# EAGLE design CPU68K8 (EAGLE 7.7.0)
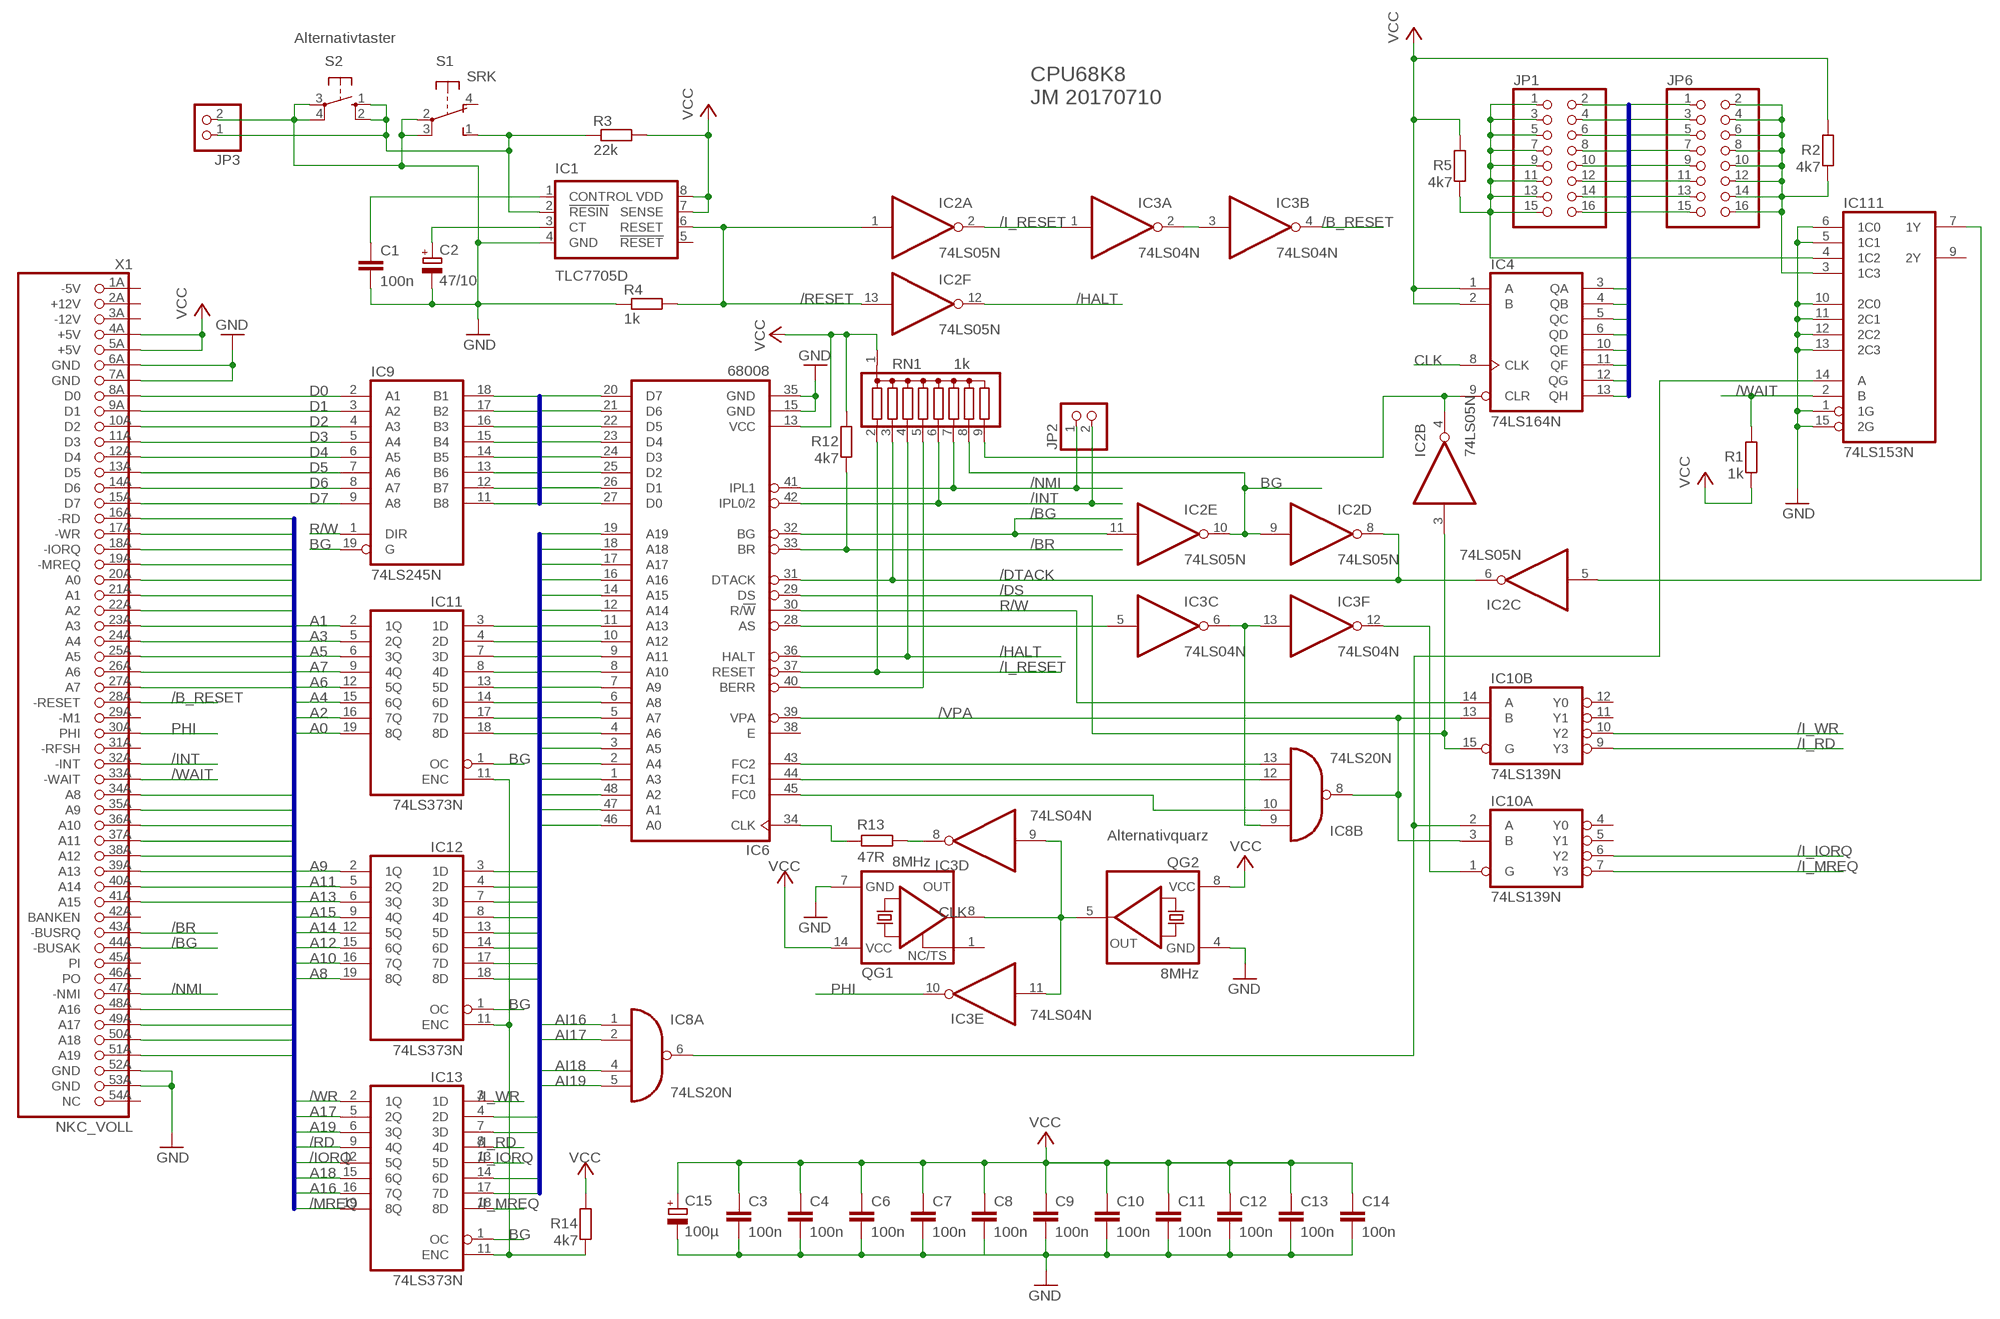
[diagram p0: schematic, sheet 1]

## Parts
C1  100n  C-EU025-025X050  [C025-025X050]
C2  47/10  CPOL-EUE2.5-6  [E2,5-6]
C3  100n  C-EU025-025X050  [C025-025X050]
C4  100n  C-EU025-025X050  [C025-025X050]
C6  100n  C-EU025-025X050  [C025-025X050]
C7  100n  C-EU025-025X050  [C025-025X050]
C8  100n  C-EU025-025X050  [C025-025X050]
C9  100n  C-EU025-025X050  [C025-025X050]
C10  100n  C-EU025-025X050  [C025-025X050]
C11  100n  C-EU025-025X050  [C025-025X050]
C12  100n  C-EU025-025X050  [C025-025X050]
C13  100n  C-EU025-025X050  [C025-025X050]
C14  100n  C-EU025-025X050  [C025-025X050]
C15  100µ  CPOL-EUE2.5-6  [E2,5-6]
IC1  TLC7705D  [DIL08]
IC2  74LS05N  [DIL14]
IC3  74LS04N  [DIL14]
IC4  74LS164N  [DIL14]
IC6  68008  MC68008P  [DIL48]
IC8  74LS20N  [DIL14]
IC9  74LS245N  [DIL20]
IC10  74LS139N  [DIL16]
IC11  74LS373N  [DIL20]
IC12  74LS373N  [DIL20]
IC13  74LS373N  [DIL20]
IC111  74LS153N  [DIL16]
JP1  PINHD-2X8  [2X08]
JP2  PINHD-1X2  [1X02]
JP3  PINHD-1X2/90  [1X02/90]
JP6  PINHD-2X8  [2X08]
QG1  8MHz  XO-14  [DIL14S]
QG2  8MHz  QG5460  [DIL08S]
R1  1k  R-EU_0207/10  [0207/10]
R2  4k7  R-EU_0207/10  [0207/10]
R3  22k  R-EU_0207/10  [0207/10]
R4  1k  R-EU_0207/10  [0207/10]
R5  4k7  R-EU_0207/10  [0207/10]
R12  4k7  R-EU_0207/10  [0207/10]
R13  47R  R-EU_0207/10  [0207/10]
R14  4k7  R-EU_0207/10  [0207/10]
RN1  1k  G08R  [SIL9]
S1  SRK  [SRK]
S2  10-XX  [B3F-10XX]
X1  NKC_VOLL  [1X54/90_PCB]

## Nets
/B_RESET: IC3.4(B:O) X1.28A(-RESET)
/BG: IC2.11(E:I) IC6.32(BG) X1.44A(-BUSAK)
/BR: IC6.33(BR) R12.1 X1.43A(-BUSRQ)
/DS: IC2.3(B:I) IC6.29(DS) IC10.15(B:G)
/DTACK: IC2.6(C:O) IC2.8(D:O) IC6.31(DTACK) RN1.3
/HALT: IC2.12(F:O) IC6.36(HALT) RN1.4
/I_IORQ: IC10.6(A:Y2) IC13.13(5D)
/I_MREQ: IC10.7(A:Y3) IC13.18(8D)
/I_RD: IC10.9(B:Y3) IC13.8(4D)
/I_RESET: IC2.2(A:O) IC3.1(A:I) IC6.37(RESET) RN1.2
/I_WR: IC10.10(B:Y2) IC13.3(1D)
/INT: IC6.42(IPL0/2) JP2.2 RN1.6 X1.32A(-INT)
/IORQ: IC13.12(5Q) X1.18A(-IORQ)
/MREQ: IC13.19(8Q) X1.19A(-MREQ)
/NMI: IC6.41(IPL1) JP2.1 RN1.7 X1.47A(-NMI)
/RD: IC13.9(4Q) X1.16A(-RD)
/RESET: IC1.6(RESET) IC2.1(A:I) IC2.13(F:I) R4.2
/VPA: IC6.39(VPA) IC8.8(B:O) IC10.3(A:B) IC10.13(B:B)
/WAIT: IC111.2(B) R1.2 X1.33A(-WAIT)
/WR: IC13.2(1Q) X1.17A(-WR)
A0: IC11.19(8Q) X1.20A(A0)
A1: IC11.2(1Q) X1.21A(A1)
A2: IC11.16(7Q) X1.22A(A2)
A3: IC11.5(2Q) X1.23A(A3)
A4: IC11.15(6Q) X1.24A(A4)
A5: IC11.6(3Q) X1.25A(A5)
A6: IC11.12(5Q) X1.26A(A6)
A7: IC11.9(4Q) X1.27A(A7)
A8: IC12.19(8Q) X1.34A(A8)
A9: IC12.2(1Q) X1.35A(A9)
A10: IC12.16(7Q) X1.36A(A10)
A11: IC12.5(2Q) X1.37A(A11)
A12: IC12.15(6Q) X1.38A(A12)
A13: IC12.6(3Q) X1.39A(A13)
A14: IC12.12(5Q) X1.40A(A14)
A15: IC12.9(4Q) X1.41A(A15)
A16: IC13.16(7Q) X1.48A(A16)
A17: IC13.5(2Q) X1.49A(A17)
A18: IC13.15(6Q) X1.50A(A18)
A19: IC13.6(3Q) X1.51A(A19)
AI0: IC6.46(A0) IC11.18(8D)
AI1: IC6.47(A1) IC11.3(1D)
AI2: IC6.48(A2) IC11.17(7D)
AI3: IC6.1(A3) IC11.4(2D)
AI4: IC6.2(A4) IC11.14(6D)
AI5: IC6.3(A5) IC11.7(3D)
AI6: IC6.4(A6) IC11.13(5D)
AI7: IC6.5(A7) IC11.8(4D)
AI8: IC6.6(A8) IC12.18(8D)
AI9: IC6.7(A9) IC12.3(1D)
AI10: IC6.8(A10) IC12.17(7D)
AI11: IC6.9(A11) IC12.4(2D)
AI12: IC6.10(A12) IC12.14(6D)
AI13: IC6.11(A13) IC12.7(3D)
AI14: IC6.12(A14) IC12.13(5D)
AI15: IC6.14(A15) IC12.8(4D)
AI16: IC6.16(A16) IC8.1(A:I0) IC13.17(7D)
AI17: IC6.17(A17) IC8.2(A:I1) IC13.4(2D)
AI18: IC6.18(A18) IC8.4(A:I2) IC13.14(6D)
AI19: IC6.19(A19) IC8.5(A:I3) IC13.7(3D)
BG: IC2.9(D:I) IC2.10(E:O) IC9.19(G) IC11.1(OC) IC12.1(OC) IC13.1(OC) RN1.8
CLK: IC3.9(D:I) IC3.11(E:I) IC4.8(CLK) QG1.8(OUT) QG2.5(OUT)
D0: IC9.2(A1) X1.8A(D0)
D1: IC9.3(A2) X1.9A(D1)
D2: IC9.4(A3) X1.10A(D2)
D3: IC9.5(A4) X1.11A(D3)
D4: IC9.6(A5) X1.12A(D4)
D5: IC9.7(A6) X1.13A(D5)
D6: IC9.8(A7) X1.14A(D6)
D7: IC9.9(A8) X1.15A(D7)
DI0: IC6.27(D0) IC9.18(B1)
DI1: IC6.26(D1) IC9.17(B2)
DI2: IC6.25(D2) IC9.16(B3)
DI3: IC6.24(D3) IC9.15(B4)
DI4: IC6.23(D4) IC9.14(B5)
DI5: IC6.22(D5) IC9.13(B6)
DI6: IC6.21(D6) IC9.12(B7)
DI7: IC6.20(D7) IC9.11(B8)
GND [supp]: C1.2 C2.- C3.2 C4.2 C6.2 C7.2 C8.2 C9.2 C10.2 C11.2 C12.2 C13.2 C14.2 C15.- IC1.4(GND) IC6.15(GND) IC6.35(GND) IC111.1(1G) IC111.5(1C1) IC111.6(1C0) IC111.10(2C0) IC111.11(2C1) IC111.12(2C2) IC111.13(2C3) IC111.15(2G) JP3.2 QG1.7(GND) QG2.4(GND) R4.1 S1.2(P) S1.3(P) S2.3(P) S2.4(P1) X1.6A(GND) X1.7A(GND) X1.52A(GND) X1.53A(GND)
N$9: IC6.43(FC2) IC8.13(B:I3)
N$10: IC6.44(FC1) IC8.12(B:I2)
N$11: IC6.45(FC0) IC8.10(B:I1)
N$12: IC3.5(C:I) IC6.28(AS)
N$13: IC3.6(C:O) IC3.13(F:I) IC8.9(B:I0)
N$14: IC6.34(CLK) R13.2
N$15: IC3.8(D:O) R13.1
N$16: IC2.4(B:O) IC4.9(CLR) RN1.9
N$17: IC3.12(F:O) IC10.1(A:G)
N$18: IC3.2(A:O) IC3.3(B:I)
N$19: IC6.40(BERR) RN1.5
N$20: IC8.6(A:O) IC10.2(A:A) IC111.14(A)
N$23: IC2.5(C:I) IC111.7(1Y)
N$24: IC11.11(ENC) IC12.11(ENC) IC13.11(ENC) R14.1
N$25: C1.1 IC1.1(CONTROL)
N$26: C2.+ IC1.3(CT)
N$27: IC111.4(1C2) JP1.1 JP1.3 JP1.5 JP1.7 JP1.9 JP1.11 JP1.13 JP1.15 R5.1
N$28: IC1.2(!RESIN) JP3.1 R3.1 S1.1(S) S2.1(S) S2.2(S1)
N$29: IC111.3(1C3) JP6.2 JP6.4 JP6.6 JP6.8 JP6.10 JP6.12 JP6.14 JP6.16 R2.1
PHI: IC3.10(E:O) X1.30A(PHI)
R/W: IC6.30(R/!W) IC9.1(DIR) IC10.14(B:A)
VCC [supp]: C3.1 C4.1 C6.1 C7.1 C8.1 C9.1 C10.1 C11.1 C12.1 C13.1 C14.1 C15.+ IC1.7(SENSE) IC1.8(VDD) IC4.1(A) IC4.2(B) IC6.13(VCC) QG1.14(VCC) QG2.8(VCC) R1.1 R2.2 R3.2 R5.2 R12.2 R14.2 RN1.1 X1.4A(+5V) X1.5A(+5V)
WAIT1: IC4.3(QA) JP1.2 JP6.1
WAIT2: IC4.4(QB) JP1.4 JP6.3
WAIT3: IC4.5(QC) JP1.6 JP6.5
WAIT4: IC4.6(QD) JP1.8 JP6.7
WAIT5: IC4.10(QE) JP1.10 JP6.9
WAIT6: IC4.11(QF) JP1.12 JP6.11
WAIT7: IC4.12(QG) JP1.14 JP6.13
WAIT8: IC4.13(QH) JP1.16 JP6.15
Unconnected: IC1.5(!RESET) IC6.38(E) IC10.4(A:Y0) IC10.5(A:Y1) IC10.11(B:Y1) IC10.12(B:Y0) IC111.9(2Y) QG1.1(TS) S1.4(O) X1.29A(-M1) X1.31A(-RFSH) X1.42A(BANKEN) X1.45A(PI) X1.46A(PO) X1.54A(NC)

## Buses
A[0..19],/RD,/WR,/IORQ,/MREQ
DI[0..7]
AI[0..19]
WAIT[1..8]

## Notes on the sheet
- Alternativtaster
- CPU68K8
  JM 20170710
- Alternativquarz

## Power pins joined to a net without a drawn wire
+12V: X1.2A(+12V)
-5V: X1.1A(-5V)
-12V: X1.3A(-12V)
GND: IC2.7(P:GND) IC3.7(P:GND) IC4.7(GND) IC8.7(P:GND) IC9.10(GND) IC10.8(P:GND) IC11.10(GND) IC12.10(GND) IC13.10(GND) IC111.8(GND)
VCC: IC2.14(P:VCC) IC3.14(P:VCC) IC4.14(VCC) IC8.14(P:VCC) IC9.20(VCC) IC10.16(P:VCC) IC11.20(VCC) IC12.20(VCC) IC13.20(VCC) IC111.16(VCC)

## Library data of the parts
C1 C3 C4 C6-C14 = rcl:C-EU: CAPACITOR, European symbol
C2 C15 = rcl:CPOL-EU: POLARIZED CAPACITOR, European symbol
IC1 = texas:TLC77*: MICROPOWER SUPPLY VOLTAGE SUPERVISORS Source: www.ti.com/.. slvs087l.pdf; MF: TEXAS INSTRUMENT CONNECTORS; MPN: TLC7705QP; OC_FARNELL: 8454671; OC_NEWARK: 76C7537
IC2 = 74xx-eu:74*05: Hex INVERTER, open collector
IC3 = 74xx-eu:74*04: Hex INVERTER
IC4 = 74xx-eu:74*164: 8-bit parallel out SHIFT REGISTER
IC6 = micro-mc68000:MC68008P: 68xxx PROCESSOR; OC_FARNELL: unknown; OC_NEWARK: unknown
IC8 = 74xx-eu:74*20: Dual 4-input NAND gate
IC9 = 74xx-eu:74*245: Octal BUS TRANSCEIVER, 3-state
IC10 = 74xx-eu:74*139: Dual 2-line to 4-line DECODER/DEMULTIPLEXER
IC11-IC13 = 74xx-eu:74*373: Octal D type transparent LATCH, edge triggered
IC111 = 74xx-eu:74*153: Dual 4-line to 1-line data SELECTOR/MULTIPLEXER
JP1 JP6 = pinhead:PINHD-2X8: PIN HEADER
JP2 JP3 = pinhead:PINHD-1X2: PIN HEADER
QG1 = crystal:XO-: CRYSTAL; OC_FARNELL: unknown; OC_NEWARK: unknown
QG2 = crystal:QG5460: CRYSTAL RESONATOR; OC_FARNELL: unknown; OC_NEWARK: unknown
R1-R5 R12-R14 = resistor:R-EU_: RESISTOR, European symbol
RN1 = resistor-sil:G08R: SIL RESISTOR; OC_FARNELL: unknown; OC_NEWARK: unknown
S1 = switch-misc:SRK: SWITCH
S2 = switch-omron:10-XX: OMRON SWITCH; MPN: B3F-1000; OC_FARNELL: 176432; OC_NEWARK: 36M3542
X1 = $eigene:NKC_VOLL

## Board
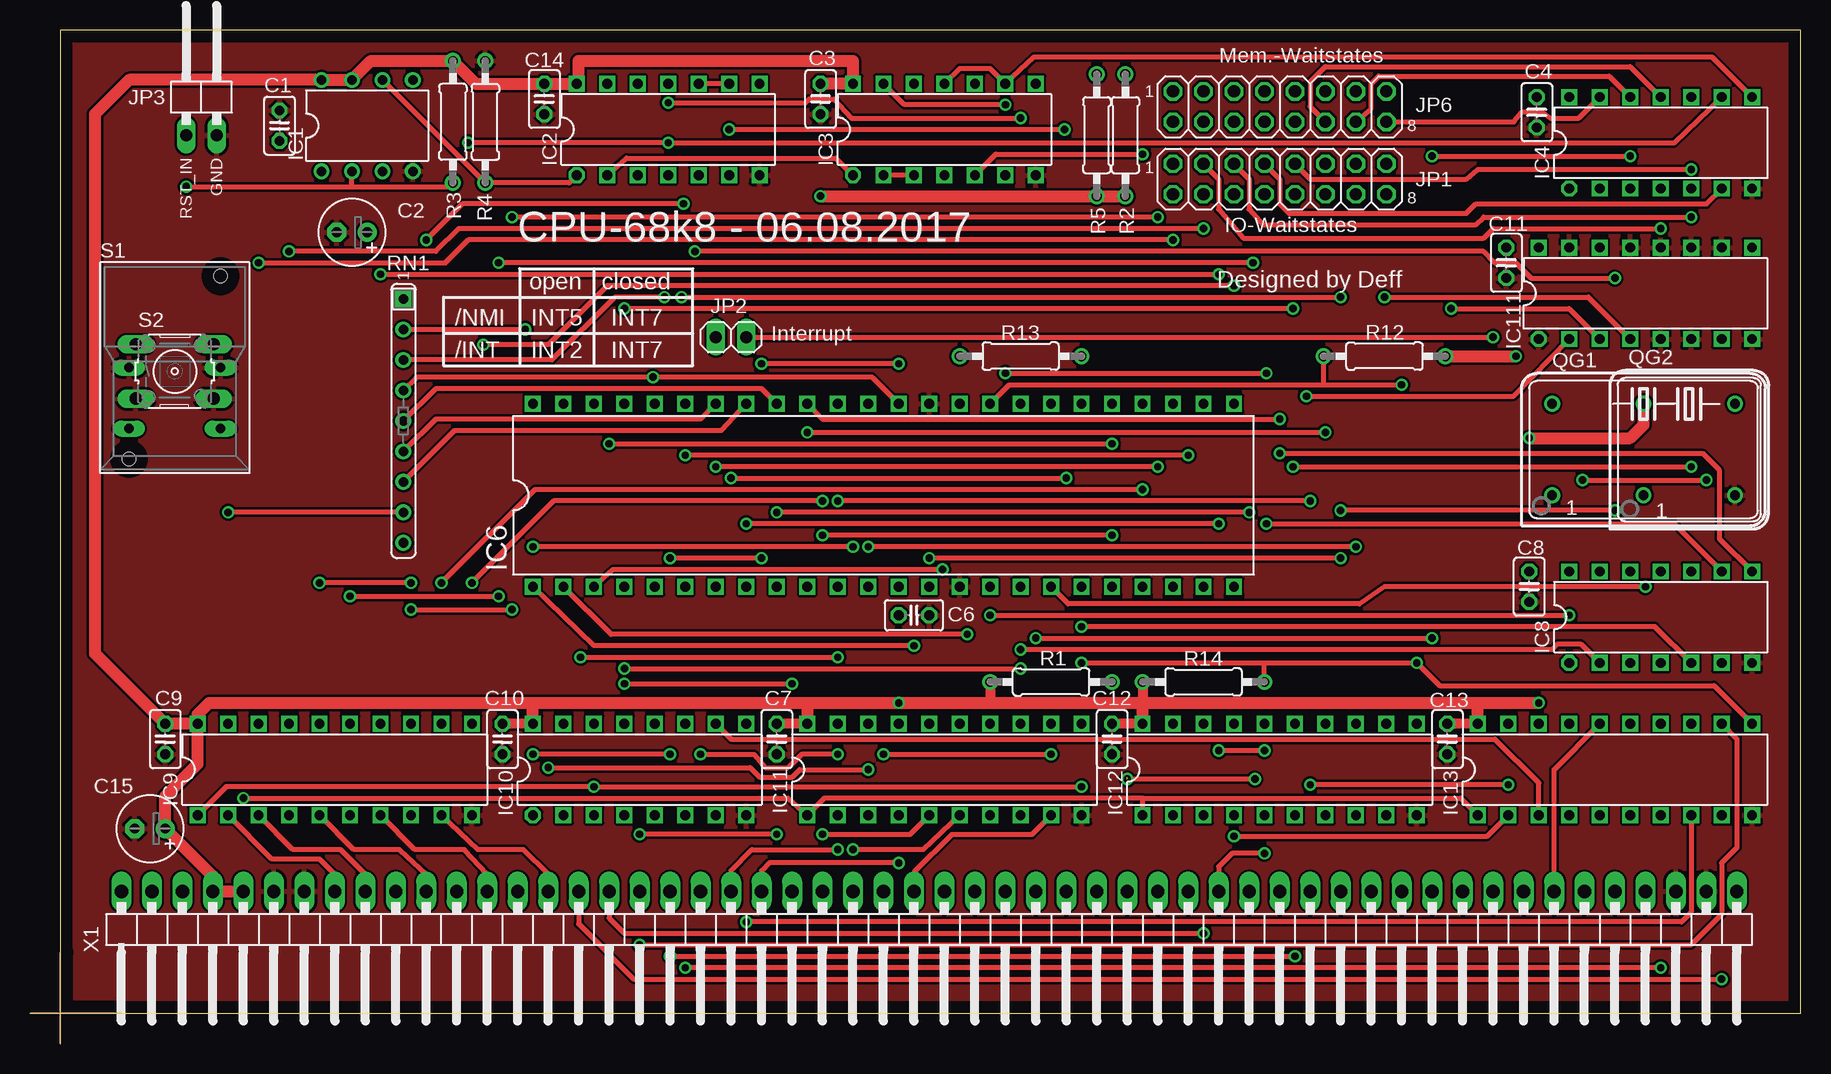
[diagram p1: board, top side]
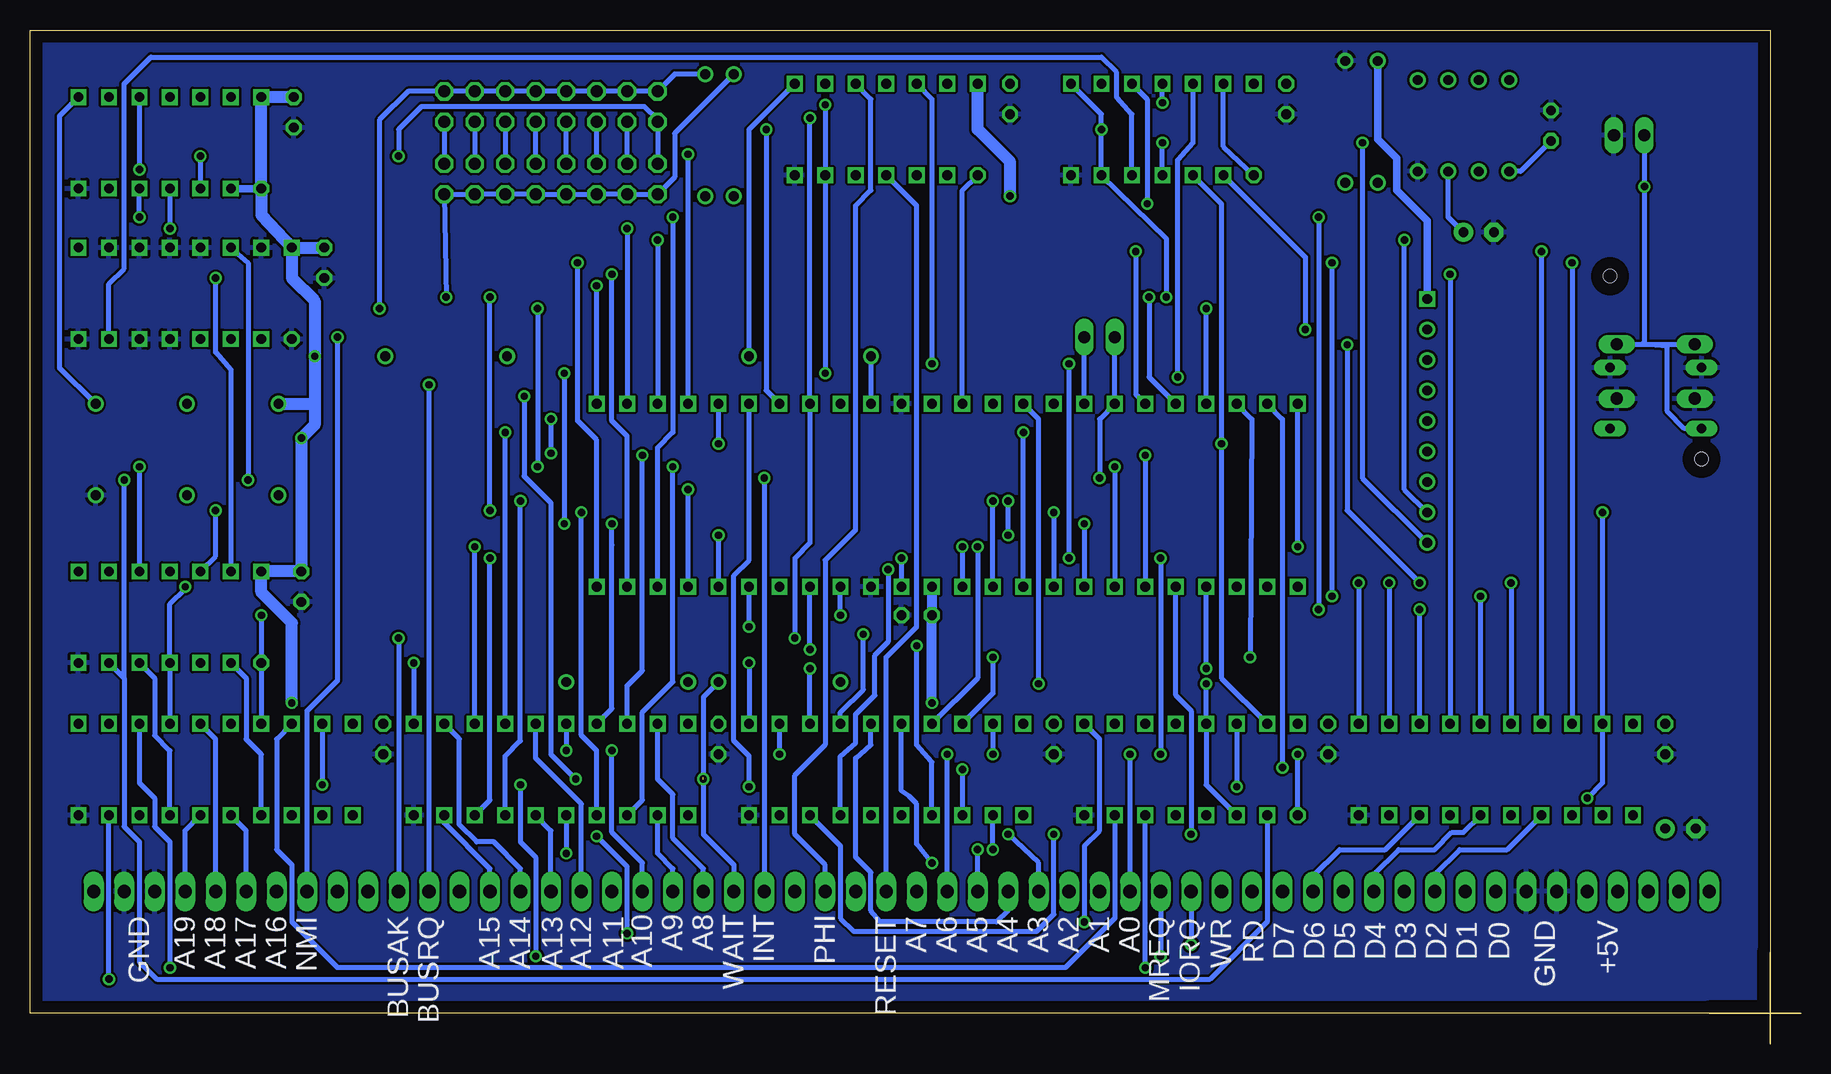
[diagram p2: board, bottom side, seen from below]

Size 145.01 x 81.95 mm. Coordinates in mm from the lower left corner, seen from the top.
Outline: 0,0 145.01,0 145.01,81.95 0,81.95 0,0
Copper layers (1*16): Top 0.035mm / dielectric 1.5mm / Bottom 0.035mm
Design rules "default": minimum track width 10mil, minimum drill 24mil, track to track 8mil, track to pad 8mil, pad to pad 8mil, via to via 8mil, smd to smd 8mil, copper to edge 40mil, drill to drill 8mil, minimum pad ring 10mil, minimum via ring 8mil, stop-mask expansion 4mil, vias tented up to drill 0mil, thermal gap 10mil

### Footprints (pad centres in the part's own frame; a part is rotated, then mirrored left to right if it is on the bottom)
C025-025X050 = drill 0.813 octagon: 1 -1.27,0; 2 1.27,0
E2,5-6 = drill 0.813 pad 1.6: + -1.27,0 | drill 0.813 pad 1.6 octagon: - 1.27,0
DIL08 = drill 0.813 pad 1.27: 1 -3.81,-3.81; 2 -1.27,-3.81; 3 1.27,-3.81; 4 3.81,-3.81; 5 3.81,3.81; 6 1.27,3.81; 7 -1.27,3.81; 8 -3.81,3.81
DIL14 = drill 0.813 octagon: 1 -7.62,-3.81 | drill 0.813 square: 2 -5.08,-3.81; 3 -2.54,-3.81; 4 0,-3.81; 5 2.54,-3.81; 6 5.08,-3.81; 7 7.62,-3.81; 8 7.62,3.81; 9 5.08,3.81; 10 2.54,3.81; 11 0,3.81; 12 -2.54,3.81; 13 -5.08,3.81; 14 -7.62,3.81
DIL48 = drill 0.813 square: 1 -29.21,-7.62; 2 -26.67,-7.62; 3 -24.13,-7.62; 4 -21.59,-7.62; 5 -19.05,-7.62; 6 -16.51,-7.62; 7 -13.97,-7.62; 8 -11.43,-7.62; 9 -8.89,-7.62; 10 -6.35,-7.62; 11 -3.81,-7.62; 12 -1.27,-7.62; 13 1.27,-7.62; 14 3.81,-7.62; 15 6.35,-7.62; 16 8.89,-7.62; 17 11.43,-7.62; 18 13.97,-7.62; 19 16.51,-7.62; 20 19.05,-7.62; 21 21.59,-7.62; 22 24.13,-7.62; 23 26.67,-7.62; 24 29.21,-7.62; 25 29.21,7.62; 26 26.67,7.62; 27 24.13,7.62; 28 21.59,7.62; 29 19.05,7.62; 30 16.51,7.62; 31 13.97,7.62; 32 11.43,7.62; 33 8.89,7.62; 34 6.35,7.62; 35 3.81,7.62; 36 1.27,7.62; 37 -1.27,7.62; 38 -3.81,7.62; 39 -6.35,7.62; 40 -8.89,7.62; 41 -11.43,7.62; 42 -13.97,7.62; 43 -16.51,7.62; 44 -19.05,7.62; 45 -21.59,7.62; 46 -24.13,7.62; 47 -26.67,7.62; 48 -29.21,7.62
DIL20 = drill 0.813 square: 1 -11.43,-3.81; 2 -8.89,-3.81; 3 -6.35,-3.81; 4 -3.81,-3.81; 5 -1.27,-3.81; 6 1.27,-3.81; 7 3.81,-3.81; 8 6.35,-3.81; 9 8.89,-3.81; 10 11.43,-3.81; 11 11.43,3.81; 12 8.89,3.81; 13 6.35,3.81; 14 3.81,3.81; 15 1.27,3.81; 16 -1.27,3.81; 17 -3.81,3.81; 18 -6.35,3.81; 19 -8.89,3.81; 20 -11.43,3.81
DIL16 = drill 0.813 octagon: 1 -8.89,-3.81 | drill 0.813 square: 2 -6.35,-3.81; 3 -3.81,-3.81; 4 -1.27,-3.81; 5 1.27,-3.81; 6 3.81,-3.81; 7 6.35,-3.81; 8 8.89,-3.81; 9 8.89,3.81; 10 6.35,3.81; 11 3.81,3.81; 12 1.27,3.81; 13 -1.27,3.81; 14 -3.81,3.81; 15 -6.35,3.81; 16 -8.89,3.81
2X08 = drill 1.016 octagon: 1 -8.89,-1.27; 2 -8.89,1.27; 3 -6.35,-1.27; 4 -6.35,1.27; 5 -3.81,-1.27; 6 -3.81,1.27; 7 -1.27,-1.27; 8 -1.27,1.27; 9 1.27,-1.27; 10 1.27,1.27; 11 3.81,-1.27; 12 3.81,1.27; 13 6.35,-1.27; 14 6.35,1.27; 15 8.89,-1.27; 16 8.89,1.27
1X02 = drill 1.016 long: 1 -1.27,0; 2 1.27,0
1X02/90 = drill 1.016 long: 1 -1.27,-3.81; 2 1.27,-3.81
DIL14S = drill 0.813: 1 -7.62,-3.81; 7 7.62,-3.81; 8 7.62,3.81; 14 -7.62,3.81
DIL08S = drill 0.813: 1 -3.81,-3.81; 4 3.81,-3.81; 5 3.81,3.81; 8 -3.81,3.81
0207/10 = drill 0.813: 1 -5.08,0; 2 5.08,0
SIL9 = drill 0.813 square: 1 -10.16,0 | drill 0.813: 2 -7.62,0; 3 -5.08,0; 4 -2.54,0; 5 0,0; 6 2.54,0; 7 5.08,0; 8 7.62,0; 9 10.16,0
SRK = drill 0.813 long: 1 -3.81,-5.08; 2 -3.81,0; 3 3.81,0; 4 3.81,-5.08 | hole 1.118: -3.81,-7.62; 3.81,7.62
B3F-10XX = drill 1.016 long: 1 -3.251,2.261; 2 3.251,2.261; 3 -3.251,-2.261; 4 3.251,-2.261
1X54/90_PCB = drill 1.1 pad 1.524 long: 1A -63.5,3.81; 2A -60.96,3.81; 3A -58.42,3.81; 4A -55.88,3.81; 5A -53.34,3.81; 6A -50.8,3.81; 7A -48.26,3.81; 8A -45.72,3.81; 9A -43.18,3.81; 10A -40.64,3.81; 11A -38.1,3.81; 12A -35.56,3.81; 13A -33.02,3.81; 14A -30.48,3.81; 15A -27.94,3.81; 16A -25.4,3.81; 17A -22.86,3.81; 18A -20.32,3.81; 19A -17.78,3.81; 20A -15.24,3.81; 21A -12.7,3.81; 22A -10.16,3.81; 23A -7.62,3.81; 24A -5.08,3.81; 25A -2.54,3.81; 26A 0,3.81; 27A 2.54,3.81; 28A 5.08,3.81; 29A 7.62,3.81; 30A 10.16,3.81; 31A 12.7,3.81; 32A 15.24,3.81; 33A 17.78,3.81; 34A 20.32,3.81; 35A 22.86,3.81; 36A 25.4,3.81; 37A 27.94,3.81; 38A 30.48,3.81; 39A 33.02,3.81; 40A 35.56,3.81; 41A 38.1,3.81; 42A 40.64,3.81; 43A 43.18,3.81; 44A 45.72,3.81; 45A 48.26,3.81; 46A 50.8,3.81; 47A 53.34,3.81; 48A 55.88,3.81; 49A 58.42,3.81; 50A 60.96,3.81; 51A 63.5,3.81; 52A 66.04,3.81; 53A 68.58,3.81; 54A 71.12,3.81

### Placement (x,y rotation side)
C1  18.26,73.98 90 top
C2  24.29,65.09 180 top
C3  63.34,76.2 270 top
C4  123.03,75.09 270 top
C6  71.12,33.18 0 top
C7  59.69,22.86 270 top
C8  122.4,35.56 270 top
C9  8.73,22.86 270 top
C10  36.83,22.86 270 top
C11  120.49,62.55 270 top
C12  87.63,22.86 270 top
C13  115.57,22.86 270 top
C14  40.32,76.2 270 top
C15  7.46,15.4 180 top
IC1  25.56,73.98 0 top
IC2  50.64,73.66 0 top
IC3  73.66,73.66 0 top
IC4  133.35,72.55 0 top
IC6  68.58,43.18 0 top
IC8  133.35,33.02 0 top
IC9  22.86,20.32 0 top
IC10  48.26,20.32 0 top
IC11  73.66,20.32 0 top
IC12  101.6,20.32 0 top
IC13  129.54,20.32 0 top
IC111  132.08,60.01 0 top
JP1  101.6,69.53 0 top
JP2  55.88,56.36 180 top
JP3  11.75,76.99 0 top
JP6  101.6,75.56 0 top
QG1  131.92,46.99 0 top
QG2  135.73,46.99 0 top
R1  82.55,27.62 0 top
R2  88.74,73.18 270 top
R3  32.7,74.3 90 top
R4  35.4,74.3 270 top
R5  86.36,73.18 270 top
R12  110.33,54.77 0 top
R13  80.01,54.77 180 top
R14  95.25,27.62 180 top
RN1  28.57,49.37 270 top
S1  9.53,53.82 0 top
S2  9.53,53.5 0 top
X1  68.58,6.35 0 top

### Tracks (layer width: path | path; a pad name or v marks a point on that pad's centre or on a via)
/B_RESET
  Bottom 0.406: X1.28A 73.66,29.69 71.12,32.23 71.12,67.31 IC3.4
/BG  (via drill 0.61)
  Top 0.406: v50.64,75.88 62.07,75.88 62.39,76.2 64.45,76.2 65.88,74.61 v80.01,74.61 | v81.28,31.27 v114.3,31.27
  Bottom 0.406: v50.64,75.88 IC2.11 | v80.01,74.61 IC6.32 80.01,39.21 81.28,37.94 v81.28,31.27 | v114.3,31.27 X1.44A
/BR  (via drill 0.61)
  Top 0.406: IC6.33 79.06,52.39 105.09,52.39 | 105.09,52.39 v111.76,52.39 | R12.1 105.25,52.55 105.09,52.39
  Bottom 0.406: v111.76,52.39 X1.43A
/DS  (via drill 0.61)
  Top 0.406: v45.72,47.47 v87.63,47.47
  Bottom 0.406: IC10.15 45.72,27.94 v45.72,47.47 45.72,67.47 IC2.3 | v87.63,47.47 IC6.29
/DTACK  (via drill 0.61)
  Top 0.406: RN1.3 40.96,54.45 46.2,59.69 v50.32,59.69 | v55.72,73.66 v83.66,73.66
  Bottom 0.406: v50.32,59.69 50.32,64.61 IC2.6 v55.72,73.66 55.72,74.93 IC2.8 | v83.66,73.66 83.66,51.91 IC6.31
/HALT  (via drill 0.61)
  Top 0.406: IC6.36 67.63,53.02 v49.37,53.02 29.69,53.02 RN1.4
  Bottom 0.406: v49.37,53.02 49.37,71.12 48.1,72.55 IC2.12
/I_IORQ  (via drill 0.61)
  Top 0.406: v133.35,3.81 v52.07,3.81
  Bottom 0.406: v52.07,3.81 IC10.6 | v133.35,3.81 133.35,14.29 134.62,15.56 134.62,17.94 135.89,19.21 IC13.13
/I_MREQ
  Bottom 0.406: IC13.18 124.46,22.86 124.46,13.65 123.19,12.38 123.19,7.62 119.38,3.81 58.74,3.81 54.61,7.94 IC10.7
/I_RD  (via drill 0.61)
  Top 0.406: IC13.8 135.89,8.41 135.1,7.62 v57.15,7.62
  Bottom 0.406: v57.15,7.62 57.15,13.97 55.88,15.24 55.88,22.86 IC10.9
/I_RESET  (via drill 0.61)
  Top 0.406: IC3.1 64.61,71.28 47.15,71.28 IC2.2 | v38.73,56.99 RN1.2
  Bottom 0.406: v38.73,56.99 38.73,63.02 IC2.2 | IC6.37 67.31,68.58 IC3.1
/I_WR
  Top 0.406: IC13.3 123.19,19.21 119.54,22.86 55.88,22.86 IC10.10
/INT  (via drill 0.61)
  Top 0.406: v55.88,44.61 v83.82,44.61 | IC6.42 53.34,49.53 31.27,49.53 RN1.6
  Bottom 0.406: JP2.2 IC6.42 55.88,49.53 v55.88,44.61 | v83.82,44.61 X1.32A
/IORQ  (via drill 0.61)
  Top 0.406: v48.26,5.71 135.89,5.71 138.43,8.26 138.43,12.54 139.7,13.81 139.7,22.86 IC13.12
  Bottom 0.406: X1.18A v48.26,5.71
/MREQ  (via drill 0.61)
  Top 0.406: v50.8,4.76 v102.87,4.76 | v120.65,19.05 v104.14,19.05
  Bottom 0.406: X1.19A v50.8,4.76 | IC13.19 v120.65,19.05 | v104.14,19.05 104.14,14.29 102.87,13.02 v102.87,4.76
/NMI  (via drill 0.61)
  Top 0.406: JP2.1 v119.38,56.36 | IC6.41 55.09,48.58 32.86,48.58 RN1.7
  Bottom 0.406: IC6.41 JP2.1 | X1.47A 121.92,25.24 119.38,27.78 v119.38,56.36
/RD  (via drill 0.61)
  Top 0.406: v138.43,2.86 47.78,2.86 43.18,7.46 X1.16A
  Bottom 0.406: v138.43,2.86 IC13.9
/RESET
  Top 0.406: IC2.1 42.39,69.22 R4.2 IC1.6
  Bottom 0.406: IC2.1 45.56,72.23 IC2.13
/VPA  (via drill 0.61)
  Top 0.406: v46.99,27.46 v60.96,27.46 | v101.6,49.53 63.5,49.53 IC6.39 | v101.6,46.67 136.84,46.67 138.27,45.24 138.27,39.53 IC8.8
  Bottom 0.406: IC10.3 46.99,19.05 IC10.13 v46.99,27.46 | v60.96,27.46 60.96,49.53 IC6.39 | v101.6,49.53 v101.6,46.67
/WAIT  (via drill 0.61)  (1 unrouted)
  Top 0.406: v99.54,19.53 v88.9,19.53 | v103.82,51.44 121.13,51.44 IC111.2
  Bottom 0.406: v103.82,51.44 103.82,44.77 101.6,42.55 101.6,21.59 v99.54,19.53 | v88.9,19.53 88.9,14.92 86.36,12.38 X1.33A | R1.2 88.9,26.35 88.9,19.68 88.74,19.53
/WR  (via drill 0.61)
  Top 0.406: v95.25,6.67 46.99,6.67 45.72,7.94 X1.17A | v97.79,14.76 118.9,14.76 IC13.2
  Bottom 0.406: v97.79,14.76 95.25,12.22 v95.25,6.67
A0  (via drill 0.61)
  Top 0.406: v53.34,21.59 57.78,21.59 58.74,20.48 60.64,20.48 61.75,21.59 v64.77,21.59
  Bottom 0.406: X1.20A v53.34,21.59 | IC11.19 v64.77,21.59
A1  (via drill 0.61)
  Top 0.406: X1.21A 55.88,11.91 57.63,13.65 v64.77,13.65
  Bottom 0.406: v64.77,13.65 IC11.2
A2  (via drill 0.61)
  Top 0.406: v69.85,12.54 59.05,12.54 58.42,11.91 X1.22A
  Bottom 0.406: IC11.16 72.39,18.57 71.75,18.1 71.12,17.46 71.12,14.13 v69.85,12.54
A3  (via drill 0.61)
  Top 0.406: IC11.5 70.8,14.92 v63.5,14.92
  Bottom 0.406: X1.23A 60.96,12.54 v63.5,14.92
A4
  Bottom 0.406: IC11.15 74.93,22.38 76.2,21.27 76.2,13.02 74.93,11.75 74.93,8.57 74.14,7.62 64.45,7.62 63.5,8.57 X1.24A
A5  (via drill 0.61)
  Top 0.406: IC11.6 71.91,13.65 v66.04,13.65
  Bottom 0.406: X1.25A v66.04,13.65
A6  (via drill 0.61)
  Top 0.406: v68.58,21.59 v82.55,21.59
  Bottom 0.406: v82.55,21.59 IC11.12 | X1.26A v68.58,21.59
A7
  Top 0.406: IC11.9 80.96,14.92 74.3,14.92 71.12,11.75 X1.27A
A8
  Bottom 0.406: X1.34A 88.9,12.06 91.44,14.61 91.44,18.26 92.71,19.53 IC12.19
A9
  Bottom 0.406: X1.35A 91.44,12.06 92.71,13.34 IC12.2
A10  (via drill 0.61)
  Top 0.406: v100.33,21.91 v96.52,21.91
  Bottom 0.406: v96.52,21.91 96.52,15.08 93.98,12.54 X1.36A | IC12.16 v100.33,21.91
A11  (via drill 0.61)
  Top 0.406: v100.33,13.34 97.63,13.34 96.52,12.22 X1.37A
  Bottom 0.406: IC12.5 v100.33,13.34
A12
  Bottom 0.406: X1.38A 99.06,17.46 102.87,21.27 IC12.15
A13
  Bottom 0.406: IC12.6 101.6,15.24 X1.39A
A14
  Bottom 0.406: IC12.12 109.3,22.94 109.22,22.86 109.22,15.72 107.79,14.29 106.36,14.29 104.14,12.06 X1.40A
A15
  Bottom 0.406: X1.41A 106.68,12.06 110.49,15.88 IC12.9
A16
  Top 0.406: X1.48A 124.46,20.32 IC13.16
A17
  Bottom 0.406: IC13.5 127,15.24 X1.49A
A18
  Bottom 0.406: IC13.15 129.54,22.86 X1.50A
A19
  Bottom 0.406: IC13.6 132.08,15.24 X1.51A
AI0  (via drill 0.61)
  Top 0.406: v43.34,29.69 v64.77,29.69
  Bottom 0.406: v43.34,29.69 43.18,49.53 IC6.46 | v64.77,29.69 64.77,26.67 IC11.18
AI1  (via drill 0.61)
  Top 0.406: v40.64,20.48 57.47,20.48 58.26,19.68 60.96,19.68 61.59,20.32 v67.31,20.32
  Bottom 0.406: v67.31,20.32 IC11.3 | v40.64,20.48 40.64,49.53 IC6.47
AI2  (via drill 0.61)
  Top 0.406: v66.04,38.89 v39.37,38.89
  Bottom 0.406: v39.37,38.89 IC6.48 | v66.04,38.89 66.04,27.94 IC11.17
AI3  (via drill 0.61)
  Top 0.406: IC6.1 44.45,30.64 v71.12,30.64
  Bottom 0.406: v71.12,30.64 71.12,22.38 69.85,20.95 IC11.4
AI4  (via drill 0.61)
  Top 0.406: IC6.2 45.88,31.59 v75.56,31.59
  Bottom 0.406: IC11.14 77.47,25.08 75.56,26.99 v75.56,31.59
AI5  (via drill 0.61)
  Top 0.406: IC6.3 46.04,36.99 v73.5,36.99
  Bottom 0.406: IC11.7 77.47,21.43 76.2,22.54 76.2,24.92 74.61,26.51 74.61,29.84 73.5,30.96 v73.5,36.99
AI6  (via drill 0.61)
  Top 0.406: v46.99,28.73 v80.01,28.73
  Bottom 0.406: IC11.13 v80.01,28.73 | v46.99,28.73 IC6.4
AI7  (via drill 0.61)
  Top 0.406: v59.69,14.92 v48.26,14.92
  Bottom 0.406: IC6.5 49.53,26.51 48.26,25.24 v48.26,14.92 | IC11.8 77.47,13.97 77.47,7.94 76.36,6.83 61.12,6.83 59.69,8.26 v59.69,14.92
AI8  (via drill 0.61)
  Top 0.406: v93.98,46.51 v52.07,46.51
  Bottom 0.406: v52.07,46.51 IC6.6 | v93.98,46.51 93.98,28.57 95.25,27.3 IC12.18
AI9  (via drill 0.61)
  Top 0.406: v91.44,45.56 v54.61,45.56
  Bottom 0.406: v54.61,45.56 IC6.7 | v91.44,45.56 91.44,27.62 93.98,25.08 93.98,17.78 IC12.3
AI10  (via drill 0.61)
  Top 0.406: v96.52,40.8 v57.15,40.8
  Bottom 0.406: v57.15,40.8 IC6.8 | 96.52,39.05 v96.52,40.8 96.52,25.4 IC12.17
AI11  (via drill 0.61)
  Top 0.406: v99.06,41.75 v59.69,41.75
  Bottom 0.406: v99.06,41.75 99.06,23.18 97.79,21.91 IC12.4 | v59.69,41.75 IC6.9
AI12  (via drill 0.61)
  Top 0.406: v62.23,48.42 v105.41,48.42
  Bottom 0.406: IC12.14 v105.41,48.42 | IC6.10 v62.23,48.42
AI13  (via drill 0.61)
  Top 0.406: v104.14,42.7 v64.77,42.7
  Bottom 0.406: v104.14,42.7 104.14,22.7 105.41,21.43 IC12.7 | IC6.11 v64.77,42.7
AI14  (via drill 0.61)
  Top 0.406: v107.95,38.89 v67.31,38.89
  Bottom 0.406: v67.31,38.89 IC6.12 | IC12.13 v107.95,38.89
AI15  (via drill 0.61)
  Top 0.406: v106.68,37.94 v72.39,37.94
  Bottom 0.406: v72.39,37.94 IC6.14 | v106.68,37.94 106.68,17.78 IC12.8
AI16  (via drill 0.61)
  Top 0.406: v77.47,33.18 v125.73,33.18
  Bottom 0.406: IC13.17 IC8.1 v125.73,33.18 | v77.47,33.18 IC6.16
AI17  (via drill 0.61)
  Top 0.406: v80.01,30.32 124.3,30.32 124.78,30.8 126.68,30.8 IC8.2
  Bottom 0.406: v80.01,30.32 IC6.17 | IC8.2 127,27.94 127,22.86 125.73,21.59 IC13.4
AI18  (via drill 0.61)
  Top 0.406: IC6.18 83.98,34.13 108.27,34.13 110.33,35.56 v132.08,35.56
  Bottom 0.406: IC13.14 IC8.4 133.35,34.13 132.08,35.4 v132.08,35.56
AI19  (via drill 0.61)
  Top 0.406: v85.09,32.23 132.87,32.23 IC8.5
  Bottom 0.406: v85.09,32.23 IC6.19 | IC8.5 134.62,27.94 134.62,23.18 133.35,21.91 IC13.7
BG  (via drill 0.61)
  Top 0.406: 90.17,17.94 63.66,17.94 IC11.1 60.64,17.94 v15.24,17.94 | IC12.1 90.17,17.94 | IC13.1 116.68,17.94 90.17,17.94 | IC2.9 IC2.10 | v51.91,67.47 33.5,67.47 v30.48,64.45 | RN1.8 v13.97,41.75
  Bottom 0.406: v13.97,41.75 IC9.19 13.97,19.21 v15.24,17.94 | v30.48,64.45 30.48,43.66 RN1.8 | v51.91,67.47 51.91,76.2 IC2.10
CLK
  Top 0.406: IC3.11 74.93,78.74 77.47,78.74 IC3.9 81.12,79.69 137.64,79.69 IC4.8
  Bottom 0.406: IC4.8 142.56,74.77 142.56,53.82 QG2.5
D0
  Top 0.406: IC9.2 17.62,12.86 21.59,12.86 22.86,11.59 X1.8A
D1
  Top 0.406: X1.9A 25.4,11.59 23.34,13.65 19.37,13.65 IC9.3
D2
  Bottom 0.406: X1.10A 27.94,11.59 25.88,13.65 21.91,13.65 IC9.4
D3
  Top 0.406: IC9.5 24.45,13.65 28.26,13.65 30.48,11.59 X1.11A
D4
  Bottom 0.406: X1.12A 33.02,11.59 30.96,13.65 27.94,13.65 26.51,15.08 25.56,15.08 IC9.6
D5
  Top 0.406: X1.13A 35.56,11.59 33.66,13.65 29.53,13.65 IC9.7
D6
  Bottom 0.406: X1.14A 38.1,11.43 35.88,13.65 32.07,13.65 IC9.8
D7
  Top 0.406: X1.15A 40.64,11.59 38.58,13.65 34.77,13.65 IC9.9
DI0  (via drill 0.61)
  Top 0.406: v92.71,64.45 33.97,64.45 32.07,62.55 v16.51,62.55
  Bottom 0.406: v92.71,64.45 IC6.27 | v16.51,62.55 IC9.18
DI1  (via drill 0.61)
  Top 0.406: v95.25,65.41 33.18,65.41 31.27,63.5 v19.05,63.5
  Bottom 0.406: v95.25,65.41 IC6.26 | IC9.17 v19.05,63.5
DI2  (via drill 0.61)
  Top 0.406: v35.24,55.72 40.64,55.72 45.56,60.64 v97.79,60.64 | v29.21,35.88 v21.59,35.88
  Bottom 0.406: IC6.25 v97.79,60.64 | v35.24,55.72 35.24,41.91 v29.21,35.88 | v21.59,35.88 IC9.16
DI3  (via drill 0.61)
  Top 0.406: v99.38,62.55 v36.51,62.55 | v24.13,34.77 v36.51,34.77
  Bottom 0.406: v36.51,62.55 v36.51,34.77 | v99.38,62.55 99.38,49.37 97.79,47.78 IC6.24 | IC9.15 v24.13,34.77
DI4  (via drill 0.61)
  Top 0.406: v26.67,61.59 v96.52,61.59
  Bottom 0.406: v96.52,61.59 96.52,49.37 95.25,48.1 IC6.23 | v26.67,61.59 IC9.14
DI5  (via drill 0.61)
  Top 0.406: v91.44,66.36 v37.62,66.36 | v29.21,33.66 v37.62,33.66
  Bottom 0.406: v37.62,66.36 v37.62,33.66 | IC6.22 92.71,47.15 91.44,48.42 v91.44,66.36 | IC9.13 v29.21,33.66
DI6  (via drill 0.61)
  Top 0.406: v90.17,43.66 39.53,43.66 v31.75,35.88
  Bottom 0.406: IC6.21 v90.17,43.66 | v31.75,35.88 IC9.12
DI7  (via drill 0.61)
  Top 0.406: v63.5,42.7 41.12,42.7 v34.29,35.88 | v87.63,39.85 v63.5,39.85
  Bottom 0.406: v63.5,39.85 v63.5,42.7 | IC6.20 v87.63,39.85 | v34.29,35.88 IC9.11
GND
  pour Bottom: 0,82.03 145.03,82.03 145.03,0 0,0
  pour Top: 0,82.03 145.03,82.03 145.03,0 0,0
N$9  (via drill 0.61)
  Top 0.406: v52.86,63.5 118.59,63.5 119.54,62.55 121.28,62.55 122.56,61.28 v129.54,61.28
  Bottom 0.406: IC6.43 52.86,51.59 v52.86,63.5 | v129.54,61.28 129.54,55.09 128.27,53.66 IC8.13
N$10  (via drill 0.61)
  Top 0.406: v51.75,59.69 v106.68,59.69 | v129.54,41.91 v106.68,41.91
  Bottom 0.406: IC6.44 51.75,53.02 v51.75,59.69 | IC8.12 129.54,38.1 v129.54,41.91 | v106.68,41.91 v106.68,59.69
N$11  (via drill 0.61)
  Top 0.406: v102.71,58.74 v46.99,58.74 | v102.71,45.56 v135.89,45.56
  Bottom 0.406: IC6.45 v46.99,58.74 | v102.71,58.74 v102.71,45.56 | v135.89,45.56 IC8.10
N$12  (via drill 0.61)
  Top 0.406: v90.17,71.6 77.95,71.6 IC3.5
  Bottom 0.406: IC6.28 v90.17,71.6
N$13  (via drill 0.61)
  Top 0.406: IC3.13 70.33,75.72 v78.74,75.72 | v78.74,53.34 v100.49,53.34 | v100.49,40.8 134.46,40.8 IC8.9
  Bottom 0.406: v78.74,75.72 IC3.6 v78.74,53.34 | v100.49,53.34 v100.49,40.8
N$14
  Bottom 0.406: R13.2 IC6.34
N$15
  Bottom 0.406: R13.1 85.09,73.66 IC3.8
N$16  (via drill 0.61)
  Top 0.406: IC4.9 134.46,72.55 v50.64,72.55 v33.97,72.55
  Bottom 0.406: v33.97,72.55 33.97,44.61 RN1.9 | v50.64,72.55 IC2.4 50.64,72.39
N$17  (via drill 0.61)
  Top 0.406: v50.8,21.59 v39.37,21.59 | v58.42,37.94 v50.8,37.94 | v69.85,54.13 v58.42,54.13
  Bottom 0.406: v50.8,37.94 v50.8,21.59 | IC10.1 v39.37,21.59 | IC3.12 69.85,76.2 v69.85,54.13 | v58.42,37.94 v58.42,54.13
N$18
  Top 0.406: IC3.3 IC3.2
N$19
  Top 0.406: IC6.40 58.42,52.07 31.27,52.07 RN1.5
N$20  (via drill 0.61)
  Top 0.406: v126.84,44.45 v137.16,44.45
  Bottom 0.406: 137.16,27.94 137.16,15.56 135.89,14.29 135.89,4.29 134.46,2.86 46.67,2.86 41.91,7.62 IC10.2 | IC8.6 137.16,27.94 | 137.16,27.94 v137.16,44.45 | IC111.14 126.84,62.55 v126.84,44.45
N$23
  Bottom 0.406: IC111.7 138.43,60.8 137.16,62.07 137.16,77.47 134.94,79.69 55.72,79.69 54.45,78.42 54.45,76.36 53.18,74.93 IC2.5
N$24  (via drill 0.61)
  Top 0.406: v85.09,29.21 100.33,29.21 | 100.33,29.21 v113.03,29.21 114.94,27.3 137.79,27.3 IC13.11 | R14.1 100.33,29.21
  Bottom 0.406: v85.09,29.21 IC11.11 | v113.03,29.21 IC12.11
N$25
  Bottom 0.406: C1.1 20.8,70.17 IC1.1
N$26
  Bottom 0.406: C2.+ 26.83,66.36 IC1.3
N$27  (via drill 0.61)
  Top 0.406: v110.33,59.69 127.32,59.69 IC111.4
  Bottom 0.406: v110.33,59.69 JP1.15 JP1.13 JP1.11 JP1.9 JP1.7 JP1.5 JP1.3 JP1.1 91.28,69.69 91.28,73.34 R5.1
N$28  (via drill 0.61)
  Top 0.406: v10.48,68.9 24.29,68.9 | 24.29,68.9 IC1.2 | 24.29,68.9 32.38,68.9 R3.1
  Bottom 0.406: S2.2 10.64,55.76 | 10.64,55.76 S2.1 | 10.64,55.76 10.48,55.92 v10.48,68.9 JP3.1 | S1.1 7.14,48.74 8.57,50.16 8.57,55.6 10.64,55.76
N$29  (via drill 0.61)
  Top 0.406: v115.89,58.74 125.73,58.74 IC111.3
  Bottom 0.406: v115.89,58.74 115.89,74.45 113.51,76.83 JP6.16 JP6.14 JP6.12 JP6.10 JP6.8 JP6.6 JP6.4 JP6.2 91.28,78.26 R2.1
PHI
  Bottom 0.406: IC3.10 74.93,76.2 74.93,68.58 76.2,67.31 76.2,40.32 78.74,37.78 78.74,22.38 81.28,19.84 81.28,14.92 78.74,12.38 X1.30A
R/W  (via drill 0.61)
  Top 0.406: IC9.1 13.81,18.89 v44.45,18.89 v85.09,18.89
  Bottom 0.406: IC10.14 v44.45,18.89 | IC6.30 85.09,37.78 86.36,36.51 86.36,22.7 85.09,21.43 v85.09,18.89
VCC  (via drill 0.61)
  Top 0.813: IC13.20 C13.1 | IC10.16 C10.1 | IC12.20 C12.1 | IC11.20 C7.1 | R14.2 90.17,25.88 | R1.1 77.47,25.88
  Top 1.016: C3.1 IC3.14 66.04,79.38 43.18,79.38 43.18,77.47 C14.1 | IC9.20 C9.1 2.86,30 2.86,74.93 5.71,77.79 IC1.8 IC1.7 25.88,79.38 R3.2 34.61,77.47 C14.1 | X1.5A X1.4A 12.7,11.43 C15.+ 8.73,18.1 11.43,20.8 IC9.20 | 62.23,25.88 v69.85,25.88 77.47,25.88 90.17,25.88 | 118.11,25.88 v123.19,25.88 | R12.2 v121.28,54.77 | v122.4,47.94 130.81,47.94 131.92,49.05 QG2.8 | 39.37,25.88 12.38,25.88 11.43,24.92 IC9.20 | IC10.16 39.37,25.88 | 39.37,25.88 62.23,25.88 | 62.23,25.88 IC11.20 | IC13.20 118.11,25.88 | 90.17,25.88 118.11,25.88 | IC12.20 90.17,25.88 | C14.1 IC2.14 | v63.34,68.1 R5.2 R2.2
  Bottom 0.61: IC4.2 IC4.1 | RN1.1 28.57,66.04 31.11,68.58 31.11,71.28 32.7,72.87 R3.2
  Bottom 0.813: v69.85,25.88 C6.1 IC6.13 | 121.44,50.8 121.28,50.64
  Bottom 1.016: C4.1 IC4.14 IC4.1 125.73,66.52 IC111.16 | IC111.16 C11.1 | IC111.16 123.19,61.28 121.28,59.37 v121.28,54.77 121.28,50.64 121.28,49.05 v122.4,47.94 C8.1 IC8.14 125.73,35.08 123.19,32.54 v123.19,25.88 | QG1.14 121.44,50.8 | v63.34,68.1 63.34,70.96 66.04,73.66 IC3.14
WAIT1  (via drill 0.61)
  Top 0.406: v114.3,71.44 v130.81,71.44
  Bottom 0.406: JP1.2 JP6.1 92.71,74.45 93.82,75.56 112.39,75.56 114.3,73.66 v114.3,71.44 | v130.81,71.44 IC4.3
WAIT2  (via drill 0.61)
  Top 0.406: JP1.4 96.52,69.53 96.52,66.99 98.58,64.61 118.59,64.61 119.38,65.41 v133.35,65.41
  Bottom 0.406: JP1.4 JP6.3 | IC4.4 v133.35,65.41
WAIT3  (via drill 0.61)
  Top 0.406: JP1.6 99.06,69.53 99.06,66.99 100.17,65.72 117.95,65.72 118.59,66.36 v135.89,66.36
  Bottom 0.406: JP1.6 JP6.5 | v135.89,66.36 IC4.5
WAIT4
  Top 0.406: IC4.6 137.16,67.47 117.95,67.47 117.16,66.67 102.39,66.67 101.6,67.47 101.6,69.53 JP1.8
  Bottom 0.406: JP1.8 JP6.7
WAIT5  (via drill 0.61)
  Top 0.406: v135.89,70.33 118.11,70.33 117.16,69.53 104.14,69.53 JP1.10
  Bottom 0.406: JP1.10 JP6.9 | IC4.10 v135.89,70.33
WAIT6
  Top 0.406: IC4.11 130.81,78.9 105.41,78.9 104.14,77.63 104.14,75.56 JP6.11
  Bottom 0.406: JP6.11 JP1.12
WAIT7
  Top 0.406: IC4.12 129.06,78.11 109.86,78.11 109.22,77.47 109.22,75.41 JP6.13
  Bottom 0.406: JP6.13 JP1.14
WAIT8
  Top 0.406: JP6.15 121.13,74.3 121.76,75.09 123.51,75.09 124.14,74.61 126.52,74.61 IC4.13
  Bottom 0.406: JP6.15 JP1.16

### Text on the board
tNames: Mem.-Waitstates | 1 | 8 | 1 | GND | 8 | RST_IN | IO-Waitstates | CPU-68k8 - 06.08.2017 | open | closed | Designed by Deff | /NMI | INT5 | INT7 | Interrupt | /INT | INT2 | INT7
bNames: +5V | GND | D0 | D1 | D2 | D3 | D4 | D5 | D6 | D7 | RD | WR | IORQ | MREQ | A0 | A1 | A2 | A3 | A4 | A5 | A6 | A7 | RESET | PHI | INT | WAIT | A8 | A9 | A10 | A11 | A12 | A13 | A14 | A15 | BUSRQ | BUSAK | NMI | A16 | A17 | A18 | A19 | GND